# EAGLE design utilidong-test-OR-1.1 (EAGLE 6.5.0)
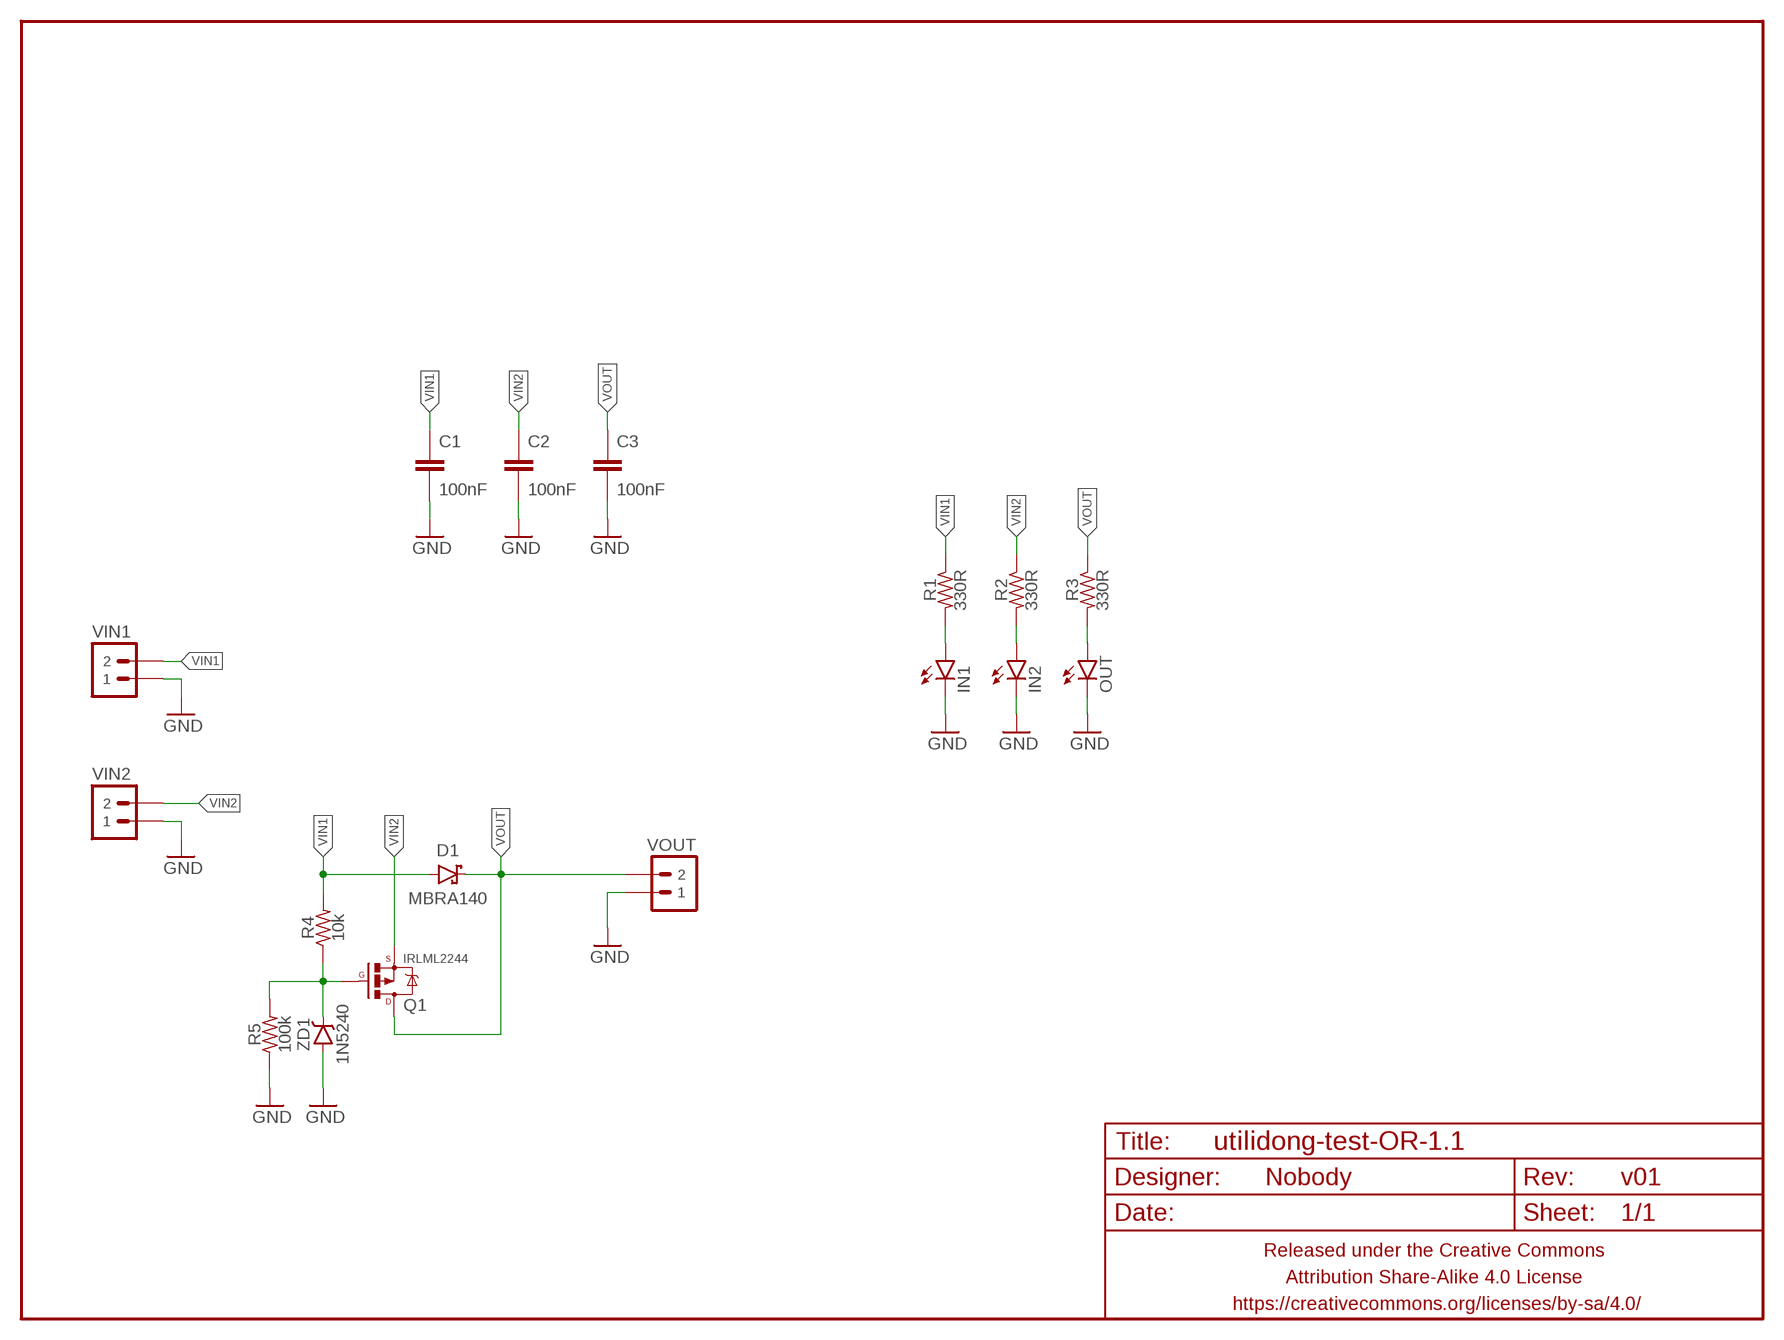
[diagram p0: schematic, sheet 1]

## Parts
C1  100nF  CAPACITOR-CERAMICC0805  [C0805]
C2  100nF  CAPACITOR-CERAMICC0805  [C0805]
C3  100nF  CAPACITOR-CERAMICC0805  [C0805]
D1  MBRA140  DIODE-SCHOTTKYMBRA140  [SMA-DIODE]
FRAME1  FRAME-LETTERNO_PACKAGE  [DUMMY]
IN1  LED1206  [LED-1206]
IN2  LED1206  [LED-1206]
OUT  LED1206  [LED-1206]
Q1  IRLML2244  MOSFET-PCHANNELSOT-23  [SOT23]
R1  330R  RESISTORR0805  [R0805]
R2  330R  RESISTORR0805  [R0805]
R3  330R  RESISTORR0805  [R0805]
R4  10k  RESISTORR0805  [R0805]
R5  100k  RESISTORR0805  [R0805]
VIN1  M02PTH-CENTERED-R+  [1X02-CENTER-R+]
VIN2  M02PTH-CENTERED-R+  [1X02-CENTER-R+]
VOUT  M02PTH-CENTERED-R+  [1X02-CENTER-R+]
ZD1  1N5240  DIODE-ZENERSOT23  [SOT23]

## Nets
GND: C1.2 C2.2 C3.2 IN1.C IN2.C OUT.C R5.1 VIN1.1 VIN2.1 VOUT.1 ZD1.1(A) ZD1.2(A)
N$1: IN2.A R2.2
N$2: OUT.A R3.2
N$3: IN1.A R1.2
N$9: Q1.1(G) R4.1 R5.2 ZD1.3(C)
VIN1: C1.1 D1.A R1.1 R4.2 VIN1.2
VIN2: C2.1 Q1.2(S) R2.1 VIN2.2
VOUT: C3.1 D1.C Q1.3(D) R3.1 VOUT.2

## Library data of the parts
C1-C3 = A_butts:CAPACITOR-CERAMIC: CAPACITOR, European symbol
D1 = A_butts:DIODE-SCHOTTKY: Schottky diodes in SFE's production catalog BAT20J 1A 23V 0.62Vf RB751 120mA 40V 0.37Vf PMEG4005EJ 0.5A 40V 0.42Vf MBRA140 1A 40V 0.5Vf B340A 3A 40V SMA; PROD_ID: DIO-08053
FRAME1 = A_butts:FRAME-LETTER: Schematic Frame Standard 8.5x11 US Letter frame; DESIGNER: Nobody; VERSION: v01
IN1 IN2 OUT = A_butts:LED: LEDs Standard schematic elements and footprints for 5mm, 3mm, 1206, and 0603 sized LEDs. 5mm - Spark Fun Electronics SKU : COM-00529 (and others)
Q1 = A_butts:MOSFET-PCHANNEL: Generic PMOSFET IRLML2244 - TRANS-11153 (SOT-23 -20V -4.3A) (1.Gate 2.Source 3.Drain) FQP27P06 - COM-10349 <http://www.sparkfun.com/products/10349> (TO-220 -60V -27A) (1.Gate 2.Source 3.Drain)
R1-R5 = A_butts:RESISTOR: RESISTOR, American symbol
VIN1 VIN2 VOUT = A_butts:M02: Standard 2-pin 0.1" header. Use with - straight break away headers ( PRT-00116) - right angle break away headers (PRT-00553) - swiss pins (PRT-00743) - machine pins (PRT-00117) - female headers (PRT-00115) Molex polarized connector foot print use with: PRT-08233 with associated crimp pins and housings. 2.54_SCREWTERM for use with PRT-10571. 3.5mm Screw Terminal footprints for PRT-08084 5mm Screw Terminal footprints for use with PRT-08433
ZD1 = A_butts:DIODE-ZENER: Zener Diode Production Part - 8199 3.4V Zener Voltage

## Board
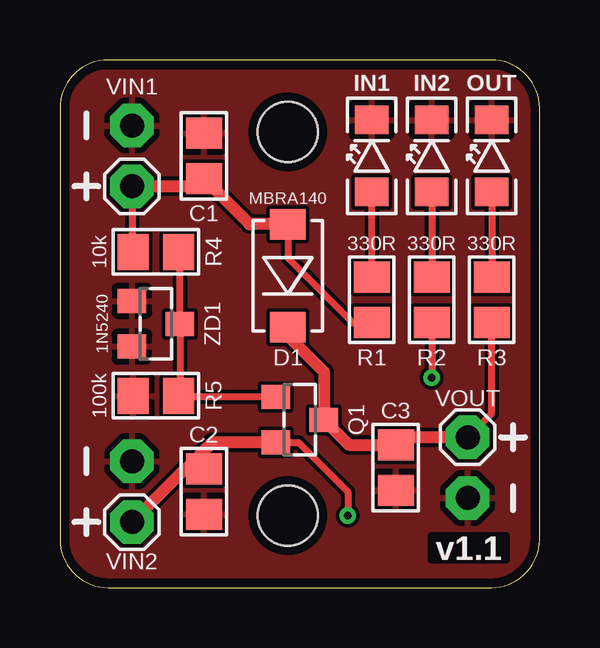
[diagram p1: board, top side]
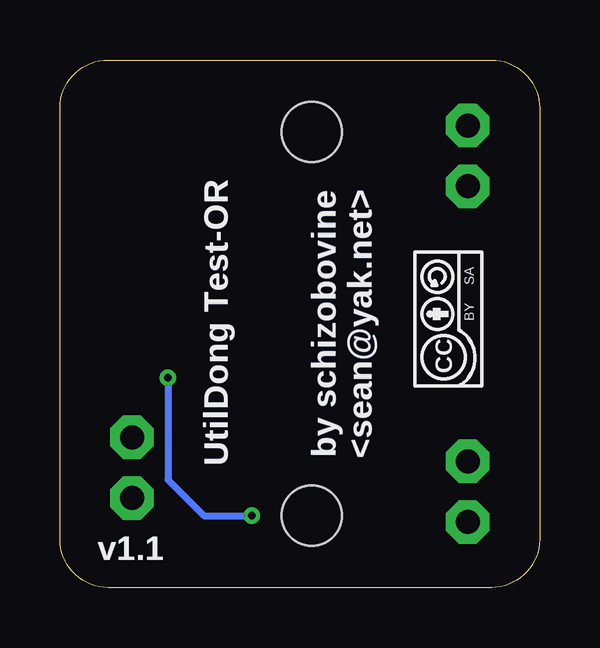
[diagram p2: board, bottom side, seen from below]

Size 20 x 22 mm. Coordinates in mm from the lower left corner, seen from the top.
Outline: 0,20 0,2 arc90 2,0 18,0 arc90 20,2 20,20 arc90 18,22 2,22 arc90 0,20
Copper layers (1*16): Top 0.0356mm / dielectric 1.5011mm / Bottom 0.0356mm
Design rules "LaenPCBOrder_2": minimum track width 6mil, minimum drill 13mil, track to track 6mil, track to pad 6mil, pad to pad 6mil, via to via 6mil, smd to smd 6mil, copper to edge 15mil, drill to drill 6mil, minimum pad ring 7mil, minimum via ring 7mil, stop-mask expansion 3mil, vias tented up to drill 20mil, thermal gap 10mil
Holes 2.5 mm at 9.5,3 9.5,19

### Footprints (pad centres in the part's own frame; a part is rotated, then mirrored left to right if it is on the bottom)
C0805 = smd 1.3 x 1.5: 1 -0.95,0; 2 0.95,0
SMA-DIODE = smd 1.27 x 1.47: A -2.15,0; C 2.15,0
LED-1206 = smd 1.2 x 1.4: A -1.5,0; C 1.5,0
SOT23 = smd 1 x 1.2: 1 -0.95,-1; 2 0.95,-1; 3 0,1
R0805 = smd 1.3 x 1.5: 1 -0.95,0; 2 0.95,0
1X02-CENTER-R+ = drill 1 pad 1.8 octagon: 1 -1.27,0; 2 1.27,0

### Placement (x,y rotation side)
C1  6,18 90 top
C2  6,4 270 top
C3  14,5 270 top
D1  9.5,13 270 top
FRAME1  0,0 0 top
IN1  13,18 90 top
IN2  15.5,18 90 top
OUT  18,18 90 top
Q1  10,7 270 top
R1  13,12 90 top
R2  15.5,12 90 top
R3  18,12 90 top
R4  4,14 180 top
R5  4,8 0 top
U$8  [CC-BY-SA-4.0-NO-URL]  3.8,11.2 90 bottom
VIN1  3,18 270 top
VIN2  3,4 270 top
VOUT  17,5 90 top
ZD1  4,11 270 top

### Tracks (layer width: path | path; a pad name or v marks a point on that pad's centre or on a via)
GND
  pour Top: -0.1,-0.1 -0.1,22.1 20.1,22.1 20.1,-0.1
N$1
  Top 0.3: IN2.A R2.2
N$2
  Top 0.3: OUT.A R3.2
N$3
  Top 0.3: R1.2 IN1.A
N$9
  Top 0.3: R4.1 5,13.95 ZD1.3 5,8.05 R5.2 5,7.95 Q1.1
VIN1
  Top 0.3: VIN1.2 3,14.05 R4.2 | D1.A 9.5,13.75 12.2,11.05 R1.1
  Top 0.5: VIN1.2 5.68,16.73 C1.1 7.9,15.15 D1.A
VIN2  (via drill 0.33)
  Top 0.3: R2.1 v15.5,8.75 | Q1.2 9.95,6.05 12,4 v12,3
  Top 0.5: C2.1 5.25,4.95 | 5.25,4.95 5.22,4.95 VIN2.2 | Q1.2 6.35,6.05 5.25,4.95
  Bottom 0.3: v15.5,8.75 15.5,4.5 14,3 v12,3
VOUT
  Top 0.3: VOUT.2 18,7.27 R3.1
  Top 0.5: D1.C 9.5,10.5 11,9 Q1.3 12.05,5.95 C3.1 14.32,6.27 VOUT.2

### Text on the board
Bottom: by schizobovine / <sean@yak.net> | UtilDong Test-OR
bPlace: by schizobovine / <sean@yak.net> | UtilDong Test-OR